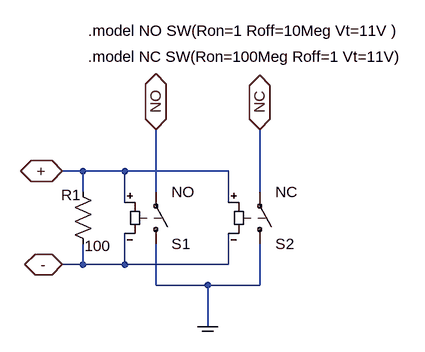
[diagram p0: schematic Relay.asc]
Relay.asc, the LTspice schematic file:
Version 4
SHEET 1 880 680
WIRE 16 80 -16 80
WIRE 80 80 16 80
WIRE 240 80 80 80
WIRE 16 112 16 80
WIRE 128 112 128 16
WIRE 288 112 288 16
WIRE 80 128 80 80
WIRE 240 128 240 80
WIRE 16 224 16 192
WIRE 16 224 -16 224
WIRE 80 224 80 176
WIRE 80 224 16 224
WIRE 240 224 240 176
WIRE 240 224 80 224
WIRE 128 256 128 192
WIRE 208 256 128 256
WIRE 288 256 288 192
WIRE 288 256 208 256
WIRE 208 320 208 256
FLAG -16 80 +
IOPIN -16 80 BiDir
FLAG -16 224 -
IOPIN -16 224 BiDir
FLAG 208 320 COM
IOPIN 208 320 BiDir
FLAG 128 16 NO
IOPIN 128 16 BiDir
FLAG 288 16 NC
IOPIN 288 16 BiDir
SYMBOL sw 128 208 M180
SYMATTR InstName S1
SYMATTR Value NO
SYMBOL sw 288 208 M180
SYMATTR InstName S2
SYMATTR Value NC
SYMBOL res 0 96 R0
WINDOW 0 -18 21 Left 2
WINDOW 3 18 99 Left 2
SYMATTR InstName R1
SYMATTR Value 100
TEXT 24 -136 Left 2 !.model NO SW(Ron=1 Roff=10Meg Vt=11V )
TEXT 24 -96 Left 2 !.model NC SW(Ron=100Meg Roff=1 Vt=11V)

The netlist it stands for:
* Relay.asc
S1 COM NO + - NO
S2 COM NC + - NC
R1 + - 100
.model NO SW(Ron=1 Roff=10Meg Vt=11V )
.model NC SW(Ron=100Meg Roff=1 Vt=11V)
.backanno
.end